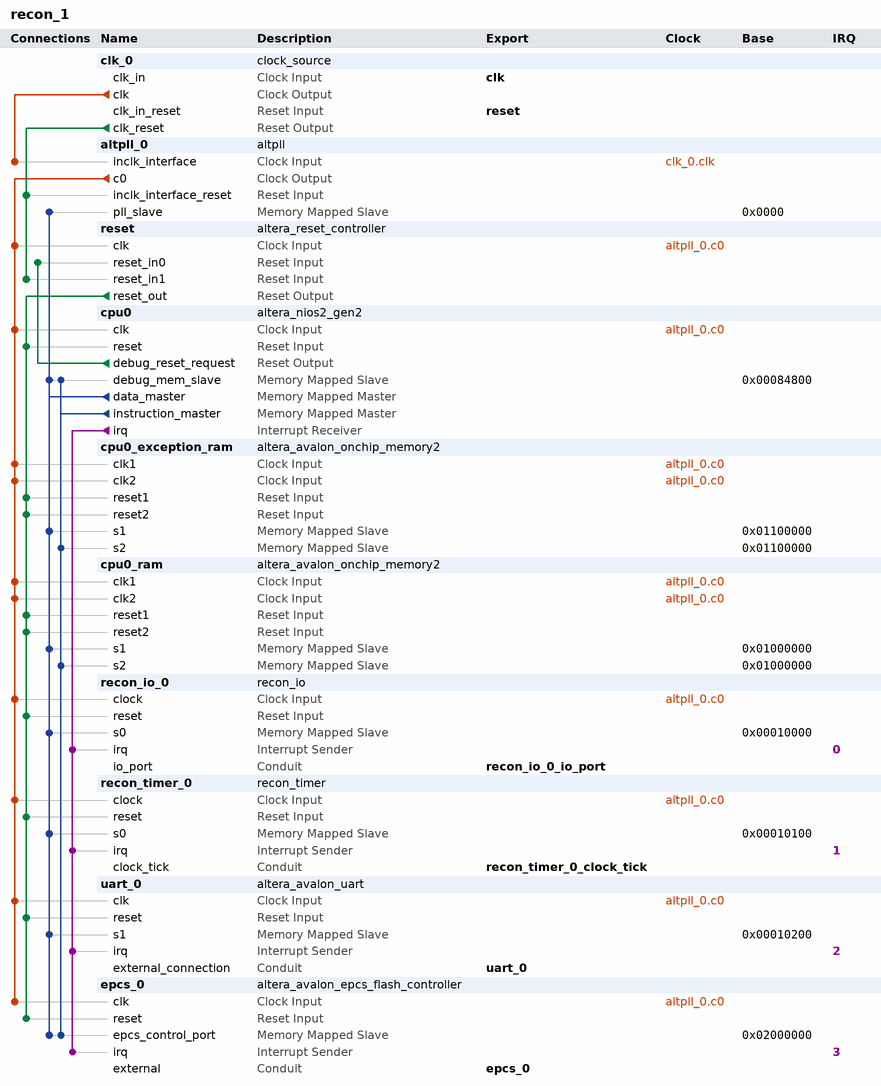
[diagram p0: system contents]
# Platform Designer (Qsys) system recon_1, Cyclone IV E EP4CE10E22C8
# Parameters at their usual value, and those the tool derives, are not listed.
package require -exact qsys 17.0
create_system recon_1
set_project_property DEVICE_FAMILY {Cyclone IV E}
set_project_property DEVICE EP4CE10E22C8

add_instance clk_0 clock_source 17.0
set_instance_parameter_value clk_0 clockFrequency 50000000
set_instance_parameter_value clk_0 resetSynchronousEdges DEASSERT

add_instance altpll_0 altpll 17.0
set_instance_parameter_value altpll_0 CLK0_DIVIDE_BY 5
set_instance_parameter_value altpll_0 CLK0_MULTIPLY_BY 8
set_instance_parameter_value altpll_0 INCLK0_INPUT_FREQUENCY 20000
set_instance_parameter_value altpll_0 PORT_ARESET PORT_UNUSED
set_instance_parameter_value altpll_0 PORT_LOCKED PORT_UNUSED
set_instance_parameter_value altpll_0 PORT_clk1 PORT_UNUSED
set_instance_parameter_value altpll_0 PORT_clk2 PORT_UNUSED
set_instance_parameter_value altpll_0 PORT_clk3 PORT_UNUSED

add_instance reset altera_reset_controller 17.0
set_instance_parameter_value reset NUM_RESET_INPUTS 2
set_instance_parameter_value reset SYNC_DEPTH 2

add_instance cpu0 altera_nios2_gen2 17.0
set_instance_parameter_value cpu0 dcache_size 2048
set_instance_parameter_value cpu0 exceptionSlave cpu0_exception_ram.s2
set_instance_parameter_value cpu0 icache_size 4096
set_instance_parameter_value cpu0 impl Tiny
set_instance_parameter_value cpu0 resetSlave epcs_0.epcs_control_port

add_instance cpu0_exception_ram altera_avalon_onchip_memory2 17.0
set_instance_parameter_value cpu0_exception_ram dataWidth 32
set_instance_parameter_value cpu0_exception_ram dualPort true
set_instance_parameter_value cpu0_exception_ram initMemContent false
set_instance_parameter_value cpu0_exception_ram initializationFileName ../mem_init/recon_1_cpu0_exception_ram.hex
set_instance_parameter_value cpu0_exception_ram memorySize 4096

add_instance cpu0_ram altera_avalon_onchip_memory2 17.0
set_instance_parameter_value cpu0_ram dataWidth 32
set_instance_parameter_value cpu0_ram dualPort true
set_instance_parameter_value cpu0_ram initMemContent false
set_instance_parameter_value cpu0_ram initializationFileName ../mem_init/onchip_mem.hex
set_instance_parameter_value cpu0_ram memorySize 32768

add_instance recon_io_0 recon_io 1.0
set_instance_parameter_value recon_io_0 PORT_WIDTH 32
set_instance_parameter_value recon_io_0 PWM_CNTR_WIDTH 10

add_instance recon_timer_0 recon_timer 1.0
set_instance_parameter_value recon_timer_0 CLK_FREQ 80000000

add_instance uart_0 altera_avalon_uart 17.0
set_instance_parameter_value uart_0 baud 115200
set_instance_parameter_value uart_0 dataBits 8
set_instance_parameter_value uart_0 fixedBaud false
set_instance_parameter_value uart_0 parity NONE
set_instance_parameter_value uart_0 stopBits 1

add_instance epcs_0 altera_avalon_epcs_flash_controller 17.0
set_instance_parameter_value epcs_0 resetrequest_enabled true
set_instance_parameter_value epcs_0 useASMIAtom true

# connections
add_connection altpll_0.c0 cpu0.clk clock
add_connection altpll_0.c0 cpu0_exception_ram.clk1 clock
add_connection altpll_0.c0 cpu0_exception_ram.clk2 clock
add_connection altpll_0.c0 cpu0_ram.clk1 clock
add_connection altpll_0.c0 cpu0_ram.clk2 clock
add_connection altpll_0.c0 epcs_0.clk clock
add_connection altpll_0.c0 recon_io_0.clock clock
add_connection altpll_0.c0 recon_timer_0.clock clock
add_connection altpll_0.c0 reset.clk clock
add_connection altpll_0.c0 uart_0.clk clock
add_connection clk_0.clk altpll_0.inclk_interface clock
add_connection clk_0.clk_reset altpll_0.inclk_interface_reset reset
add_connection clk_0.clk_reset reset.reset_in1 reset
add_connection cpu0.debug_reset_request reset.reset_in0 reset
add_connection reset.reset_out cpu0.reset reset
add_connection reset.reset_out cpu0_exception_ram.reset1 reset
add_connection reset.reset_out cpu0_exception_ram.reset2 reset
add_connection reset.reset_out cpu0_ram.reset1 reset
add_connection reset.reset_out cpu0_ram.reset2 reset
add_connection reset.reset_out epcs_0.reset reset
add_connection reset.reset_out recon_io_0.reset reset
add_connection reset.reset_out recon_timer_0.reset reset
add_connection reset.reset_out uart_0.reset reset
add_connection cpu0.data_master altpll_0.pll_slave avalon
set_connection_parameter_value cpu0.data_master/altpll_0.pll_slave baseAddress 0x0000
add_connection cpu0.data_master cpu0.debug_mem_slave avalon
set_connection_parameter_value cpu0.data_master/cpu0.debug_mem_slave baseAddress 0x00084800
add_connection cpu0.data_master cpu0_exception_ram.s1 avalon
set_connection_parameter_value cpu0.data_master/cpu0_exception_ram.s1 baseAddress 0x01100000
add_connection cpu0.data_master cpu0_ram.s1 avalon
set_connection_parameter_value cpu0.data_master/cpu0_ram.s1 baseAddress 0x01000000
add_connection cpu0.data_master epcs_0.epcs_control_port avalon
set_connection_parameter_value cpu0.data_master/epcs_0.epcs_control_port baseAddress 0x02000000
add_connection cpu0.data_master recon_io_0.s0 avalon
set_connection_parameter_value cpu0.data_master/recon_io_0.s0 baseAddress 0x00010000
add_connection cpu0.data_master recon_timer_0.s0 avalon
set_connection_parameter_value cpu0.data_master/recon_timer_0.s0 baseAddress 0x00010100
add_connection cpu0.data_master uart_0.s1 avalon
set_connection_parameter_value cpu0.data_master/uart_0.s1 baseAddress 0x00010200
add_connection cpu0.instruction_master cpu0.debug_mem_slave avalon
set_connection_parameter_value cpu0.instruction_master/cpu0.debug_mem_slave baseAddress 0x00084800
add_connection cpu0.instruction_master cpu0_exception_ram.s2 avalon
set_connection_parameter_value cpu0.instruction_master/cpu0_exception_ram.s2 baseAddress 0x01100000
add_connection cpu0.instruction_master cpu0_ram.s2 avalon
set_connection_parameter_value cpu0.instruction_master/cpu0_ram.s2 baseAddress 0x01000000
add_connection cpu0.instruction_master epcs_0.epcs_control_port avalon
set_connection_parameter_value cpu0.instruction_master/epcs_0.epcs_control_port baseAddress 0x02000000
add_connection cpu0.irq epcs_0.irq interrupt
set_connection_parameter_value cpu0.irq/epcs_0.irq irqNumber 3
add_connection cpu0.irq recon_io_0.irq interrupt
set_connection_parameter_value cpu0.irq/recon_io_0.irq irqNumber 0
add_connection cpu0.irq recon_timer_0.irq interrupt
set_connection_parameter_value cpu0.irq/recon_timer_0.irq irqNumber 1
add_connection cpu0.irq uart_0.irq interrupt
set_connection_parameter_value cpu0.irq/uart_0.irq irqNumber 2

# exported interfaces
add_interface clk clock sink
set_interface_property clk EXPORT_OF clk_0.clk_in
add_interface epcs_0 conduit end
set_interface_property epcs_0 EXPORT_OF epcs_0.external
add_interface recon_io_0_io_port conduit end
set_interface_property recon_io_0_io_port EXPORT_OF recon_io_0.io_port
add_interface recon_timer_0_clock_tick conduit end
set_interface_property recon_timer_0_clock_tick EXPORT_OF recon_timer_0.clock_tick
add_interface reset reset sink
set_interface_property reset EXPORT_OF clk_0.clk_in_reset
add_interface uart_0 conduit end
set_interface_property uart_0 EXPORT_OF uart_0.external_connection

set_interconnect_requirement {$system} qsys_mm.clockCrossingAdapter HANDSHAKE
set_interconnect_requirement {$system} qsys_mm.enableEccProtection FALSE
set_interconnect_requirement {$system} qsys_mm.insertDefaultSlave FALSE
set_interconnect_requirement {$system} qsys_mm.maxAdditionalLatency 1

save_system recon_1.qsys
